# Altium project Test1.PrjPcb
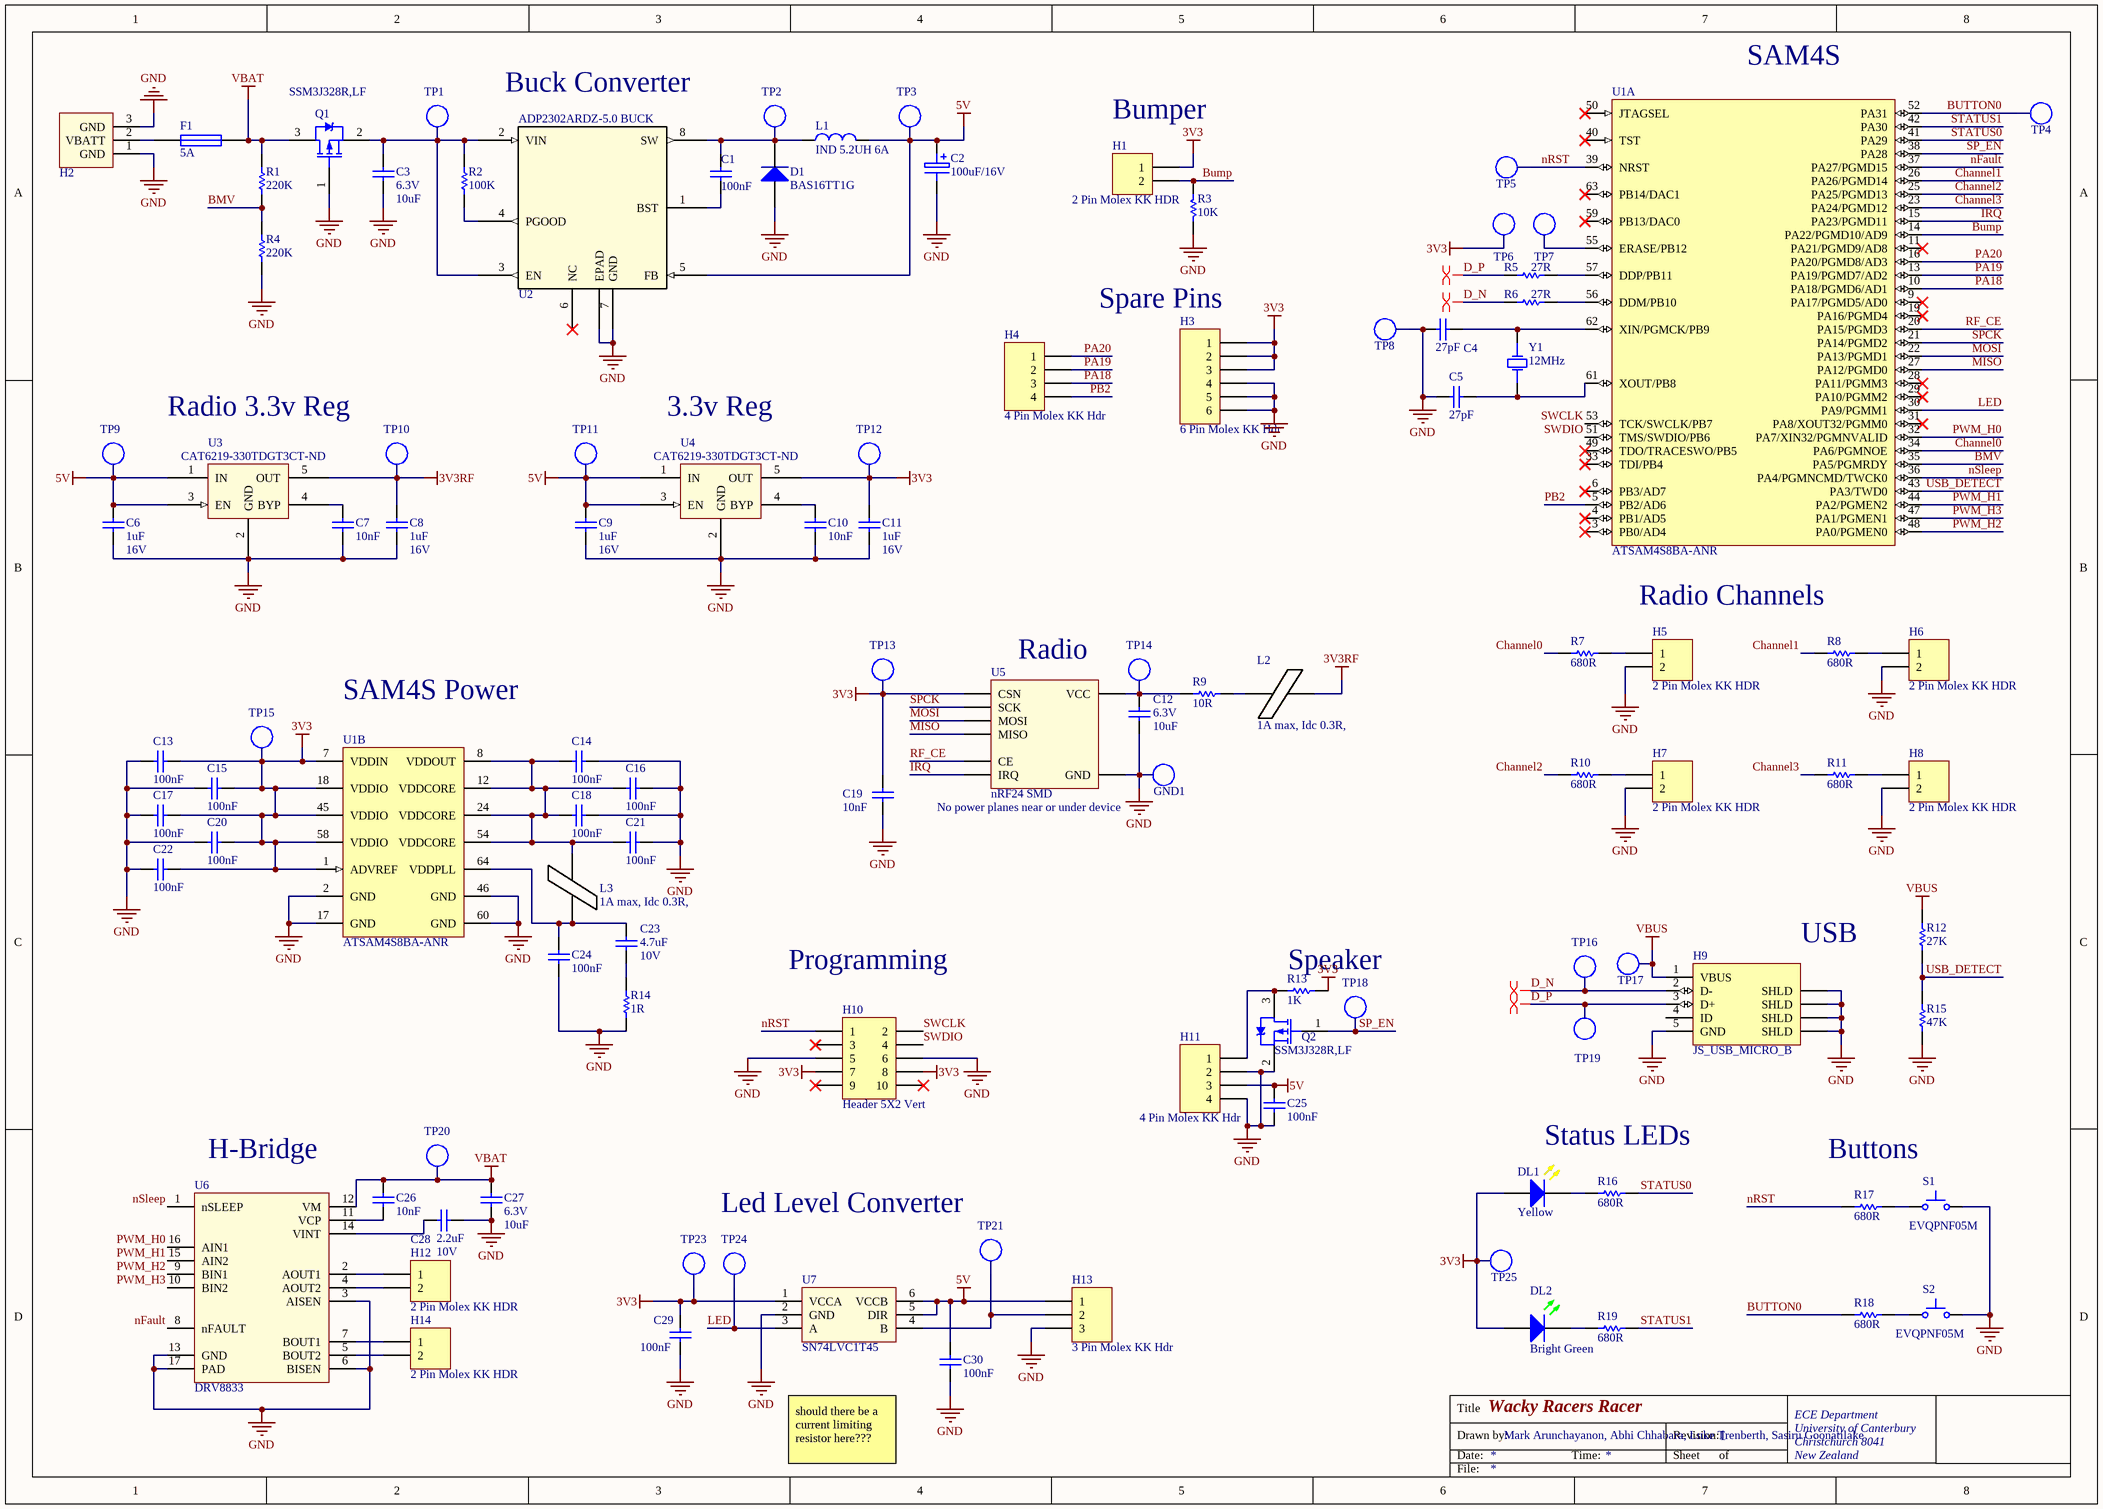
[diagram p0: racer.SchDoc]
1 sheet, 107 parts. Net scope: global (net labels, ports and power ports of the same name join across sheets).
Board file: Group9Racer.PcbDoc

## Sheet racer.SchDoc: Wacky Racers Racer
size A3; DrawnBy: Mark Arunchayanon, Abhi Chhabara, Luke Trenberth, Sasiru Goonatilake; Address1: ECE Department; Address2: University of Canterbury; Address3: Christchurch 8041; Address4: New Zealand; Revision: 1

### Parts
C1  100nF  [CAPC1608L]
C2  100uF/16V  [NICH-1]
C3  Voltage - Rated: 6.3V  [CAPC1608L]  (hidden comment: 10uF)
C4  27pF  [CAPC1608L]
C5  27pF  [CAPC1608L]
C6  Max Voltage: 16V  [CAPC1608L]  (hidden comment: 1uF)
C7  10nF  [CAPC1608L]
C8  Max Voltage: 16V  [CAPC1608L]  (hidden comment: 1uF)
C9  Max Voltage: 16V  [CAPC1608L]  (hidden comment: 1uF)
C10  10nF  [CAPC1608L]
C11  Max Voltage: 16V  [CAPC1608L]  (hidden comment: 1uF)
C12  Voltage - Rated: 6.3V  [CAPC1608L]  (hidden comment: 10uF)
C13  100nF  [CAPC1608L]
C14  100nF  [CAPC1608L]
C15  100nF  [CAPC1608L]
C16  100nF  [CAPC1608L]
C17  100nF  [CAPC1608L]
C18  100nF  [CAPC1608L]
C19  10nF  [CAPC1608L]
C20  100nF  [CAPC1608L]
C21  100nF  [CAPC1608L]
C22  100nF  [CAPC1608L]
C23  Max Voltage: 10V  [CAPC1608N]  (hidden comment: 4.7uF)
C24  100nF  [CAPC1608L]
C25  100nF  [CAPC1608L]
C26  10nF  [CAPC1608L]
C27  Voltage - Rated: 6.3V  [CAPC1608L]  (hidden comment: 10uF)
C28  Max Voltage: 10V  [CAPC1608L]  (hidden comment: 2.2uF)
C29  100nF  [CAPC1608L]
C30  100nF  [CAPC1608L]
D1  BAS16TT1G  [SOT416]
DL1  Yellow  [WL-SMCW0603]
DL2  Bright Green  [WL-SMCW0603]
F1  5A  [RESC3216N]
GND1  GND  [TP_0603]  (value not drawn)
H1  2 Pin Molex KK HDR  [MOLEX_KK_2_HDR]
H2  Battery_HEADER_3pin  [BATT_HEADER_3POS]  (value not drawn)
H3  6 Pin Molex KK Hdr  [MOLEX_KK_6_HDR]
H4  4 Pin Molex KK Hdr  [MOLEX_KK_4_HDR]
H5  2 Pin Molex KK HDR  [MOLEX_KK_2_HDR]
H6  2 Pin Molex KK HDR  [MOLEX_KK_2_HDR]
H7  2 Pin Molex KK HDR  [MOLEX_KK_2_HDR]
H8  2 Pin Molex KK HDR  [MOLEX_KK_2_HDR]
H9  JS_USB_MICRO_B  [FCI_USB_10118194-0001LF]
H10  Header 5X2 Vert  [IDC2.54-V10D]
H11  4 Pin Molex KK Hdr  [MOLEX_KK_4_HDR]
H12  2 Pin Molex KK HDR  [MOLEX_KK_2_HDR]
H13  3 Pin Molex KK Hdr  [MOLEX_KK_3_HDR]
H14  2 Pin Molex KK HDR  [MOLEX_KK_2_HDR]
L1  IND 5.2UH 6A  [INDUCTOR5u2]
L2  1A max, Idc 0.3R,  [INDC3216L]
L3  1A max, Idc 0.3R,  [INDC3216L]
Q1  SSM3J328R,LF  [SOT23_L]
Q2  SSM3J328R,LF  [SOT23_L]
R1  220K  [RESC1608L]
R2  100K  [RESC1608L]
R3  10K  [RESC1608L]
R4  220K  [RESC1608L]
R5  27R  [RESC3216L]
R6  27R  [RESC3216L]
R7  680R  [RESC1608L]
R8  680R  [RESC1608L]
R9  10R  [RESC1608L]
R10  680R  [RESC1608L]
R11  680R  [RESC1608L]
R12  27K  [RESC1608L]
R13  1K  [RESC1608L]
R14  1R  [RESC3216L]
R15  47K  [RESC1608N]
R16  680R  [RESC1608L]
R17  680R  [RESC1608L]
R18  680R  [RESC1608L]
R19  680R  [RESC1608L]
S1  EVQPNF05M  [EVQPNF05M]
S2  EVQPNF05M  [EVQPNF05M]
TP1  VBAT  [TP_0603]  (value not drawn)
TP2  5V  [TP_0603]  (value not drawn)
TP3  5V  [TP_0603]  (value not drawn)
TP4  TP_0603  [TP_0603]  (value not drawn)
TP5  nRST  [TP_0603]  (value not drawn)
TP6  3V3  [TP_0603]  (value not drawn)
TP7  Erase  [TP_0603]  (value not drawn)
TP8  GND  [TP_0603]  (value not drawn)
TP9  5V  [TP_0603]  (value not drawn)
TP10  3V3RF  [TP_0603]  (value not drawn)
TP11  5V  [TP_0603]  (value not drawn)
TP12  3V3  [TP_0603]  (value not drawn)
TP13  3V3  [TP_0603]  (value not drawn)
TP14  3V3RF  [TP_0603]  (value not drawn)
TP15  3V3  [TP_0603]  (value not drawn)
TP16  D_N  [TP_0603]  (value not drawn)
TP17  VBUS  [TP_0603]  (value not drawn)
TP18  SP_EN  [TP_0603]  (value not drawn)
TP19  D_P  [TP_0603]  (value not drawn)
TP20  VBAT  [TP_0603]  (value not drawn)
TP21  LEDB  [TP_0603]  (value not drawn)
TP23  3V3  [TP_0603]  (value not drawn)
TP24  LEDA  [TP_0603]  (value not drawn)
TP25  3V3  [TP_0603]  (value not drawn)
U1  ATSAM4S8BA-ANR  [LQFP64_L]  (parts A,B of 2)
U2  ADP2302ARDZ-5.0 BUCK  [RD_8_1]
U3  Supplier Part Number: CAT6219-330TDGT3CT-ND  [SOT95P280X145-5N]  (hidden comment: CAT6219-330TDGT3)
U4  Supplier Part Number: CAT6219-330TDGT3CT-ND  [SOT95P280X145-5N]  (hidden comment: CAT6219-330TDGT3)
U5  nRF24 SMD  Warning: No power planes near or under device  [NRF24]
U6  DRV8833  [HTSOP16]
U7  SN74LVC1T45  [SOT23-6_N]
Y1  12MHz  [6.0X3.5-4]

### Nets
3V3: C11.2 C13.1 C15.1 C17.1 C19.2 C20.1 C22.1 C29.1 DL1.2(A) DL2.2(A) H1.1 H3.1 H3.2 H3.3 H10.7 H10.8 R13.2 TP6.1(TP) TP12.1(TP) TP13.1(TP) TP15.1(TP) TP23.1(TP) TP25.1(TP) U1.1(ADVREF) U1.7(VDDIN) U1.18(VDDIO) U1.45(VDDIO) U1.58(VDDIO) U4.5(OUT) U5.4(CSN) U7.1(VCCA)
3V3RF: C8.2 L2.2 TP10.1(TP) U3.5(OUT)
5V: C2.2 C6.2 C9.2 C25.2 C30.1 H11.3 H13.1 L1.2 TP3.1(TP) TP9.1(TP) TP11.1(TP) U2.5(FB) U3.1(IN) U3.3(EN) U4.1(IN) U4.3(EN) U7.5(DIR) U7.6(VCCB)
GND: C2.1 C3.1 C4.2 C5.2 C6.1 C7.1 C8.1 C9.1 C10.1 C11.1 C12.1 C13.2 C14.1 C15.2 C16.1 C17.2 C18.1 C19.1 C20.2 C21.1 C22.2 C24.2 C25.1 C27.1 C28.2 C29.2 C30.2 D1.1(A) GND1.1(TP) H2.1(GND) H2.3(GND) H3.4 H3.5 H3.6 H5.2 H6.2 H7.2 H8.2 H9.5(GND) H9.6(SHLD) H10.5 H10.6 H11.2 H11.4 H13.3 Q1.1 Q2.2 R3.1 R4.1 R14.1 R15.1 S1.2 S2.2 TP8.1(TP) U1.2(GND) U1.17(GND) U1.46(GND) U1.60(GND) U2.7(GND) U2.EPAD U3.2(GND) U4.2(GND) U5.2(GND) U6.3(AISEN) U6.6(BISEN) U6.13(GND) U6.17(PAD) U7.2(GND)
VBAT: C26.1 C27.2 F1.2 Q1.3 R1.2 TP20.1(TP) U6.12(VM)
VBUS: H9.1(VBUS) R12.2 TP17.1(TP)
BMV: R1.1 R4.2 U1.35(PA5/PGMRDY)
Bump: H1.2 R3.2 U1.14(PA22/PGMD10/AD9)
BUTTON0: R18.1 TP4.1(TP) U1.52(PA31)
Channel0: R7.1 U1.34(PA6/PGMNOE)
Channel1: R8.1 U1.26(PA26/PGMD14)
Channel2: R10.1 U1.25(PA25/PGMD13)
Channel3: R11.1 U1.23(PA24/PGMD12)
D_N: H9.2(D-) R6.1 TP16.1(TP)
D_P: H9.3(D+) R5.1 TP19.1(TP)
IRQ: U1.15(PA23/PGMD11) U5.8(IRQ)
LED: TP24.1(TP) U1.30(PA9/PGMM1) U7.3(A)
MISO: U1.27(PA12/PGMD0) U5.7(MISO)
MOSI: U1.22(PA13/PGMD1) U5.6(MOSI)
nFault: U1.37(PA27/PGMD15) U6.8(nFAULT)
nRST: H10.1 R17.1 TP5.1(TP) U1.39(NRST)
nSleep: U1.36(PA4/PGMNCMD/TWCK0) U6.1(nSLEEP)
PA18: H4.3 U1.10(PA18/PGMD6/AD1)
PA19: H4.2 U1.13(PA19/PGMD7/AD2)
PA20: H4.1 U1.16(PA20/PGMD8/AD3)
PB2: H4.4 U1.5(PB2/AD6)
PWM_H0: U1.32(PA7/XIN32/PGMNVALID) U6.16(AIN1)
PWM_H1: U1.44(PA2/PGMEN2) U6.15(AIN2)
PWM_H2: U1.48(PA0/PGMEN0) U6.9(BIN1)
PWM_H3: U1.47(PA1/PGMEN1) U6.10(BIN2)
RF_CE: U1.20(PA15/PGMD3) U5.3(CE)
SP_EN: Q2.1 TP18.1(TP) U1.38(PA28)
SPCK: U1.21(PA14/PGMD2) U5.5(SCK)
STATUS0: R16.2 U1.41(PA29)
STATUS1: R19.2 U1.42(PA30)
SWCLK: H10.2 U1.53(TCK/SWCLK/PB7)
SWDIO: H10.4 U1.51(TMS/SWDIO/PB6)
USB_DETECT: R12.1 R15.2 U1.43(PA3/TWD0)
NetC1_1: C1.1 D1.3(K) L1.1 TP2.1(TP) U2.8(SW)
NetC1_2: C1.2 U2.1(BST)
NetC3_2: C3.2 Q1.2 R2.2 TP1.1(TP) U2.2(VIN) U2.3(EN)
NetC4_1: C4.1 U1.62(XIN/PGMCK/PB9) Y1.3(OSC2)
NetC5_1: C5.1 U1.61(XOUT/PB8) Y1.1(OSC1)
NetC7_2: C7.2 U3.4(BYP)
NetC10_2: C10.2 U4.4(BYP)
NetC12_2: C12.2 R9.1 TP14.1(TP) U5.1(VCC)
NetC14_2: C14.2 C16.2 C18.2 C21.2 L3.2 U1.8(VDDOUT) U1.12(VDDCORE) U1.24(VDDCORE) U1.54(VDDCORE)
NetC23_1: C23.1 R14.2
NetC23_2: C23.2 C24.1 L3.1 U1.64(VDDPLL)
NetC26_2: C26.2 U6.11(VCP)
NetC28_1: C28.1 U6.14(VINT)
NetDL1_1: DL1.1(K) R16.1
NetDL2_1: DL2.1(K) R19.1
NetF1_1: F1.1 H2.2(VBATT)
NetH5_1: H5.1 R7.2
NetH6_1: H6.1 R8.2
NetH7_1: H7.1 R10.2
NetH8_1: H8.1 R11.2
NetH11_1: H11.1 Q2.3 R13.1
NetH12_1: H12.1 U6.2(AOUT1)
NetH12_2: H12.2 U6.4(AOUT2)
NetH13_2: H13.2 TP21.1(TP) U7.4(B)
NetH14_1: H14.1 U6.7(BOUT1)
NetH14_2: H14.2 U6.5(BOUT2)
NetL2_1: L2.1 R9.2
NetR2_1: R2.1 U2.4(PGOOD)
NetR5_2: R5.2 U1.57(DDP/PB11)
NetR6_2: R6.2 U1.56(DDM/PB10)
NetR17_2: R17.2 S1.1
NetR18_2: R18.2 S2.1
NetTP7_1: TP7.1(TP) U1.55(ERASE/PB12)

Not connected (* = marked no-connect by the designer): H9 4(ID); H10 3* 9* 10*; U1 3(PB0/AD4)* 4(PB1/AD5)* 6(PB3/AD7)* 9(PA17/PGMD5/AD0)* 11(PA21/PGMD9/AD8)* 19(PA16/PGMD4)* 28(PA11/PGMM3)* 29(PA10/PGMM2)* 31(PA8/XOUT32/PGMM0)* 33(TDI/PB4)* 40(TST)* 49(TDO/TRACESWO/PB5)* 50(JTAGSEL)* 59(PB13/DAC0)* 63(PB14/DAC1)*; U2 6(NC)*

### Layout directives
differential pair: D_N, D_P

### Notes on the sheet
- (near U2) Buck Converter
- (near U1) SAM4S
- (near H1) Bumper
- (near H3) Spare Pins
- Radio 3.3v Reg
- 3.3v Reg
- Radio Channels
- SAM4S Power
- (near U5) Radio
- Programming
- (near R13) Speaker
- (near H9) USB
- H-Bridge
- Status LEDs
- Buttons
- Led Level Converter
- should there be a current limiting resistor here???
- Title
- Drawn by:
- Date:
- Time:
- Revision:
- Sheet
- of
- File:

### Library data of the parts
C1 C13-C18 C20-C22 C24 C25 C29 C30 = CC_100nF_0603: CAP CER 100nF X7R +-10% 50V 0603; PackageReference: 0603; Code_IPC: 1608 [0603]; Verify: *; Supplier: ECE Dept; Storage Location: PCB Assembly WS; Value: 100nF
C2 = CA_100uF_16V: CAP ALUM 100uF 16V SMD; Manufacturer PN: UWX1C101MCL1GB; Manufacturer: Nichcon; Supplier 1: Farnell; Supplier Part Number 1: 1870677; Storage Location: PCB Assembly WS; Supplier: ECE Dept; Supplier 2: Digi-Key; Supplier Part Number 2: 493-2105-1-ND; Value: 100uF/16V
C3 C12 C27 = CC_10uF_0603: CAP CER 10UF X5R +-20% 6V3 0603; Supplier: ECE Dept; Storage Location: PCB Assembly WS; Value: 10uF
C4 C5 = CC_27pF_0603: CAP CER 27pF NPO/COG +-5% 50V 0603; PackageReference: 0603; Code_IPC: 1608 [0603]; Verify: *; Supplier: ECE Dept; Storage Location: PCB Assembly WS; Value: 27pF
C6 C8 C9 C11 = CC_1uF_0603: CAP CER 1uF Y5V -20% +80% 16V 0603; PackageReference: 0603; Code_IPC: 1608 [0603]; Verify: *; Supplier: ECE Dept; Storage Location: PCB Assembly WS; Value: 1uF
C7 C10 C19 C26 = CC_10nF_0603: CAP CER 10nF X7R +-10% 50V 0603; PackageReference: 0603; Code_IPC: 1608 [0603]; Verify: *; Supplier: ECE Dept; Storage Location: PCB Assembly WS; Value: 10nF
C23 = CC_4.7uF_0603: CAP CER 4.7uF X5R +-20%  10V 0603; Note: Footprint corresponds to dimensions for bulk cassette packaging. This case size has tightened tolerances.; PackageReference: 0805; Code_IPC: 2012[0805]; Verify: *; Supplier: ECE Dept; Storage Location: PCB Assembly WS; Value: 4.7uF
C28 = CC_2.2uF_0603: CAP CER 2.2uF X5R +-20% 10V 0603; PackageReference: 0603; Code_IPC: 1608 [0603]; Verify: *; Supplier: ECE Dept; Storage Location: PCB Assembly WS; Value: 2.2uF
D1 = DR_BAS16TT1G: Diode Switching, Vr 75V, 200mA, SOT-416; Manufacturer: ON Semiconductor; Max Surge Current: 500mA; Forward Voltage: 1.25V; Peak Reverse Current: 1uA; Recovery Time: 6ns; Power Dissipation: 225mW; Element Configuration: Single; Polarity: Standard; Max Reverse Voltage (DC): 100V; Manufacturer PN: BAS16TT1G; Storage Location: PCB Assembly WS; Supplier: ECE Dept; Manufacturer Part Number: BAS16TT1G; Case/Package: SOT-416-3; Number of Pins: 3; Contact Plating: Tin,Matte; Min Operating Temperature: -55°C; Max Operating Temperature: 150°C; Package Quantity: 1; Packaging: Tape and Reel; Forward Current: 200mA; Average Rectified Current: 200mA; Reverse Recovery Time: 6ns; Peak Non-Repetitive Surge Current: 500mA; Max Repetitive Reverse Voltage (Vrrm): 75V; Max Forward Surge Current (Ifsm): 500mA; Current Rating: 200mA; Output Current: 200mA; Length: 1.65mm; Height: 0.9mm; Width: 0.9mm; Radiation Hardening: No; REACH SVHC: No SVHC; Lead Free: Lead Free; Halogen Free: Halogen Free; ComponentLink1URL: https://datasheet.ciiva.com/8299/bas16tt1-d-8299729.pdf; ComponentLink1Description: https://datasheet.ciiva.com/8299/bas16tt1-d-8299729.pdf; ComponentLink2URL: https://datasheet.ciiva.com/4435/bas16tt1-d-103455-4435027.pdf; ComponentLink2Description: https://datasheet.ciiva.com/4435/bas16tt1-d-103455-4435027.pdf; ComponentLink3URL: https://datasheet.ciiva.com/28646/bas16tt1-d-28646580.pdf; ComponentLink3Description: https://datasheet.ciiva.com/28646/bas16tt1-d-28646580.pdf; ComponentLink4URL: https://datasheet.ciiva.com/16393/bas16tt1-d-16393622.pdf; ComponentLink4Description: https://datasheet.ciiva.com/16393/bas16tt1-d-16393622.pdf; ComponentLink5URL: https://datasheet.ciiva.com/923/bas16tt1-d-923016.pdf; ComponentLink5Description: https://datasheet.ciiva.com/923/bas16tt1-d-923016.pdf; ComponentLink6URL: https://datasheet.ciiva.com/923/bas16tt1-d-923017.pdf; ComponentLink6Description: https://datasheet.ciiva.com/923/bas16tt1-d-923017.pdf; ComponentLink7URL: https://datasheet.ciiva.com/923/bas16tt1-d-923018.pdf; ComponentLink7Description: https://datasheet.ciiva.com/923/bas16tt1-d-923018.pdf; ComponentLink8URL: https://datasheet.ciiva.com/25930/bas16tt1-d-25930986.pdf; ComponentLink8Description: https://datasheet.ciiva.com/25930/bas16tt1-d-25930986.pdf; Supplier 1: Digi-Key; Supplier 2: Farnell; Supplier Part Number 2: 2844752; Supplier Part Number 1: BAS16TT1GOSDKR-ND; Value: BAS16TT1G
DL1 = DL_150060YS75000: LED Yellow 120mcd 0603 SMD; Manufacturer: WURTH ELEKTRONIK; Forward Current If: 30; Forward Voltage: 2; Wavelength Typ: 590; Lens Shape: Rectangular; Viewing Angle: 140°; Luminous Intensity: 120; LED Mounting: SMD; Supplier 1: Farnell; Supplier Part Number 1: 2322074; Manufacturer Part Number: 150060YS75000; Storage Location: PCB Assembly WS; Supplier: ECE Dept; LED Colour: Yellow
DL2 = DL_150060VS75000: LED Bright Green 40mcd 0603 SMD; Manufacturer: WURTH ELEKTRONIK; Forward Current If: 30; Forward Voltage: 2; Viewing Angle: 140°; Wavelength Typ: 570; Luminous Intensity: 40; LED Mounting: SMD; Supplier 1: Farnell; Supplier Part Number 1: 2322073; Manufacturer Part Number: 150060VS75000; Storage Location: PCB Assembly WS; Supplier: ECE Dept; LED Colour: Bright Green
F1 = FS_Fuse_5.0A: Fuse 5.0A Fast Acting 1206 SMD; Manufacturer Part Number: C1F5; Manufacturer: Bel TRP; Voltage Rating (AC): 125V; Voltage Rating (DC): 63V; DC Cold Resistance: 19mR; Fuse Type: Board Mount (Cartridge Style Excluded); Approvals: CE,cURus; Mount: Surface Mount; Case/Package: 1206; Number of Pins: 2; Case Code (Metric): 3216; Case Code (Imperial): 1206; Contact Plating: Nickel,Tin; Min Operating Temperature: -55°C; Max Operating Temperature: 125°C; Packaging: Tape and Reel; Voltage Rating: 125V; Length: 0.126inch; Width: 0.062inch; Supplier 1: Digi-Key; Stock 1: 725; Pricing 1: 1=0.32, 5=0.312, 10=0.298, 50=0.2662, 100=0.2479, 250=0.22032, 500=0.1836, 1000=0.17442 (USD); ComponentLink1URL: http://www.farnell.com/datasheets/2571625.pdf; ComponentLink1Description: http://www.farnell.com/datasheets/2571625.pdf; ComponentLink2URL: http://belfuse.com/pdfs/C1F.pdf; ComponentLink2Description: http://belfuse.com/pdfs/C1F.pdf; ComponentLink3URL: http://www.mouser.com/ds/2/643/C1F-594910.pdf; ComponentLink3Description: http://www.mouser.com/ds/2/643/C1F-594910.pdf; ComponentLink4URL: https://belfuse.com/resources/StewartConnector/C1F.pdf; ComponentLink4Description: https://belfuse.com/resources/StewartConnector/C1F.pdf; Current Rating: 5A; Supplier Part Number 1: 507-1886-1-ND; Supplier 2: Element14; Supplier Part Number 2: 2848595; Value: 5A
GND1 TP1-TP21 TP23-TP25 = TP_0603: Test Point 1.65X0.9X1.2mm SMD; Manufacturer: TE Connectivity AMP Connectors; Manufacturer Part Number: 1625854-3; Supplier 1: Digi-Key; Mounting Type: Surface Mount; Terminal: 0.063" x 0.031" x 0.045" (1.60mm x 0.80mm x 1.15mm); Type: PC Test Point; Supplier Part Number 1: A106145CT-ND
H1 H5-H8 H12 H14 = JA_MOLEX_KK_2POS: CONN HEADER 2POS 2.54mm VERT_Thru Hole; Supplier 1: Farnell; Supplier Part Number 1: 1462926; Supplier: ECE Dept; Storage Location: ECE Dept Store; Value: 2 Pin Molex KK HDR
H2 = Battery_HEADER_3pin: 3Pin Header 2.54mm spacing
H3 = JA_MOLEX_KK_6POS: CONN HEADER 6POS 2.54mm VERT_Thru Hole; Supplier 1: Farnell; Supplier Part Number 1: 1462922; Supplier: ECE Dept; Storage Location: ECE Dept Store; Value: 6 Pin Molex KK Hdr
H4 H11 = JA_MOLEX_KK_4POS: CONN HEADER 4POS 2.54mm VERT_Thru Hole; Manufacturer: Molex; Supplier 1: Farnell; Supplier Part Number 1: 9731164; Supplier: ECE Dept; Storage Location: ECE Dept Store; Value: 4 Pin Molex KK Hdr; Manufacturer PN: 22-23-2041
H9 = JS_USB_MICRO_B_SMT: CONN USB MICRO B RECPT SMT R/A; Manufacturer: FCI; Manufacturer Part Number: 10118194-0001LF; Gender: Receptacle; Number of Contacts: 5; Specifications: USB 2.0; Supplier 1: Digi-Key; Supplier Part Number 1: 609-4618-1-ND; Features: Shielded, Solder Retention; Mounting Type: Surface Mount, Right Angle, Horizontal
H10 = JA_HDR_IDC_5X2_VERT: IDC Header, 2,54mm, 10-Pin, Vert; Supplier: ECE Dept; Supplier 1: Farnell; Supplier Part Number 1: 1096985; Storage Location: ECE Dept Store
H13 = JA_MOLEX_KK_3POS: CONN HEADER 3POS 2.54mm VERT_Thru Hole; Supplier 1: Farnell; Supplier Part Number 1: 9731156; Manufacturer: Molex; Supplier: ECE Dept; Storage Location: ECE Dept Store; Value: 3 Pin Molex KK Hdr; Manufacturer PN: 22-23-2031
L1 = CDRH104RNP-5R2NC: FIXED IND 5.2UH 6A 22 MOHM SMD; Manufacturer: Sumida America Components Inc.; Material - Core: Ferrite; Tolerance: ±30%; Current - Saturation: 5.6A; Shielding: Shielded; DC Resistance (DCR): 22 mOhm Max; Supplier 1: Digi-Key; Manufacturer Part Number: CDRH104RNP-5R2NC; RoHS: RoHS Compliant; Category: Inductors, Coils, Chokes; Stock 1: 3849; Pricing 1: 1=2.9, 10=2.678, 100=1.8743, 500=1.5173 (NZD); Packaging: Cut Tape (CT); Part Status: Active; Type: -; Q @ Freq: -; Frequency - Self Resonant: -; Ratings: -; Operating Temperature: -40°C ~ 100°C; Mounting Type: Surface Mount; Package / Case: Nonstandard; Supplier Device Package: -; Size / Dimension: 0.402" L x 0.394" W (10.20mm x 10.00mm); Height - Seated (Max): 0.157" (4.00mm); ComponentLink1URL: http://products.sumida.com/products/pdf/CDRH104R.pdf; ComponentLink1Description: http://products.sumida.com/products/pdf/CDRH104R.pdf; Supplier Part Number 1: 308-2280-1-ND
L2 L3 = IN_Ferrite-Bead: Ferrite Bead, Rdc 0.3R, Z100MHZ 600R, Imax 1A, SMD 1206; Manufacturer: FAIR-RITE; Manufacturer PN: 2512066017Y1; DC Current Rating: 1; DC Resistance Max: 0.08; Ferrite Case Style: 1206 ^3216 Metric]; Frequency Range: 50MHz to 1; Impedance: 600; Impedance Tolerance: ± 25%; Supplier: ECE Dept; Storage Location: PCB Assembly WS; Ferrite Mounting: SMD; Supplier 1: Farnell; Supplier Part Number 1: 1612060; Manufacturer Part Number: 2512066017Y1; Value: 1A max, Idc 0.3R,
Q1 Q2 = TM_SSM3J328R: MOSFET P-CH 20V 6A SOT23-3; Manufacturer: Toshiba; FET Feature: Logic Level Gate, 1.5V Drive; FET Type: MOSFET P-Channel, Metal Oxide; Gate Charge (Qg) @ Vgs: 12.8nC @ 4.5V; Input Capacitance (Ciss) @ Vds: 840pF @ 10V; Power - Max: 1W; Rds On Max: 29.8mR; Drain to Source Resistance: 47.4mR; Turn-On Delay Time: 32ns; Power Dissipation: 2W; Number of Channels: 1; Turn-Off Delay Time: 107ns; Gate to Source Voltage (Vgs): 8V; Input Capacitance: 840pF; Element Configuration: Single; Drain to Source Breakdown Voltage: -20V; Vgs(th) (Max) @ Id: 1V @ 1mA; Current - Continuous Drain (Id) @ 25° C: 6A; Drain to Source Voltage (Vdss): 20V; Package / Case: SOT-23-3 Flat Leads; Supplier Device Package: SOT-23F; Pricing: 1=0.79, 10=0.658, 25=0.5772, 100=0.4939, 250=0.42836, 500=0.36284, 1000=0.27972 (NZD); Storage Location: PCB Assembly WS; Supplier: Digi-Key; ComponentLink1URL: https://datasheet.ciiva.com/11158/ssm3j328r-datasheet-en-20140301-11158652.pdf; ComponentLink1Description: https://datasheet.ciiva.com/11158/ssm3j328r-datasheet-en-20140301-11158652.pdf; Supplier Part Number: SSM3J328RLFDKR-ND; Max Operating Temperature: 150°C; Mount: Surface Mount; Packaging: Tape and Reel; Min Operating Temperature: -55°C; Continuous Drain Current (ID): 6A; Radiation Hardening: No; Max Power Dissipation: 1W; Package Quantity: 3000; Case/Package: SOT-23-3; Number of Pins: 3; Number of Elements: 1; Supplier 1: Digi-Key; Supplier Part Number 1: SSM3J328RLFDKR-ND; Manufacturer Part Number: SSM3J328R,LF
R1 R4 = RS_220K: RES 3.3K OHM 1/10W 5% 0603 SMD; Storage Location: PCB Assembly WS; Supplier: ECE Dept; Value: 220K
R2 = RS_100K: RES 100K OHM 1/10W 5% 0603 SMD; Storage Location: PCB Assembly WS; Supplier: ECE Dept; Value: 100K
R3 = RS_10K: RES 10.0K OHM 1/10W 5% 0603 SMD; Storage Location: PCB Assembly WS; Supplier: ECE Dept; Value: 10K
R5 R6 = RT_27R: RES 27R OHM 1/4W 5% 1206 SMD; Storage Location: PCB Assembly WS; Supplier: ECE Dept; Value: 27R
R7 R8 R10 R11 R16-R19 = RS_680R: RES 680 OHM 1/10W 5% 0603 SMD; Storage Location: PCB Assembly WS; Supplier: ECE Dept; Value: 680R
R9 = RS_10R: RES 10 OHM 1/10W 5% 0603 SMD; Storage Location: PCB Assembly WS; Supplier: ECE Dept; Value: 10R
R12 = RS_27K: RES 27K OHM 1/10W 5% 0603 SMD; Storage Location: PCB Assembly WS; Supplier: ECE Dept; Value: 27K
R13 = RS_1K: RES 1.0K OHM 1/10W 5% 0603 SMD; Storage Location: PCB Assembly WS; Supplier: ECE Dept; Value: 1K
R14 = RT_1R: RES 1R OHM 1/4W 5% 1206 SMD; Storage Location: PCB Assembly WS; Supplier: ECE Dept; Value: 1R
R15 = RS_47K: RES 47.0K OHM 1/10W 5% 0603 SMD; Storage Location: PCB Assembly WS; Supplier: ECE Dept; Value: 47K
S1 S2 = WS_EVQPNF05M: Panasonic 6 x 3.5mm SMD Light Touch Switch Type SMD; PackageDescription: 6.0 x 3.5 mm; Supplier 1: Farnell; Supplier Part Number 1: 2079481; Manufacturer: Panasonic; Manufacturer PN: EVQPNF05M; Supplier 2: Digi-Key; Supplier Part Number 2: P13598SCT-ND; Storage Location: PCB Assembly WS; Supplier: ECE Dept
U1 = SE_ATSAM4S16BA-MU: IC MCU 32BIT 512KB FLASH 64LQFP; Manufacturer: Atmel; Connectivity: I²C, IrDA, Memory Card, SPI, SSC, UART/USART, USB; Core Processor: ARM® Cortex®-M4; Core Size: 32-Bit; Data Converters: A/D 11x12b, D/A 2x12b; Number of I/O: 47; Peripherals: Brown-out Detect/Reset, DMA, POR, PWM, WDT; Program Memory Size: 512KB (512K x 8); RAM Size: 128K x 8; Speed: 120MHz; Voltage - Supply (Vcc/Vdd): 1.62 V ~ 3.6 V; PackageVersion: revJ, Jul-2007; PackageReference: 64PS; PackageDescription: 64-Pin Quad Flat No-Lead (QFN) Sawn, 9 x 9 x 1.0 mm Body, 0.5 mm Pitch, Exposed Pad; Code_JEDEC: MO-220VMMD-3; ComponentLink1Description: Manufacturer URL; ComponentLink1URL: http://www.atmel.com/; ComponentLink2Description: SAM4S Series Datasheet; ComponentLink2URL: http://www.atmel.com/dyn/resources/prod_documents/11100.pdf; ComponentLink3Description: SAM4S Series Summary; ComponentLink3URL: http://www.atmel.com/dyn/resources/prod_documents/11100S.pdf; Supplier 1: Digi-Key; Package / Case: 64-LQFP; Packaging: Cut Tape (CT); Program Memory Type: FLASH; Supplier Part Number 1: ATSAM4S8BA-ANRCT-ND; Manufacturer Part Number: ATSAM4S8BA-ANR
U2 = ADP2302ARDZ-5.0-R7: IC REG BUCK 5V 2A 8SOIC; Vendor: Analog Devices Inc; Frequency - Switching: 700kHz; Output Type: Fixed; Voltage - Input (Max): 20V; Manufacturer_Part_Number: ADP2302ARDZ-5.0-R7; Type: DEV; Value: Value; Supplier 1: Digi-Key; Current - Output: 2A; Voltage - Output (Min/Fixed): 5V; Supplier Part Number 1: ADP2302ARDZ-5.0-R7CT-ND
U3 U4 = SV_CAT6219-330TDGT3: IC REG LIN 3.3V 500MA TSOT23-5; Voltage - Input (Max): 5.5V; Voltage Dropout (Max): 0.5V @ 500mA; Manufacturer Part Number: CAT6219-330TDGT3; Base Part Number: CAT6219; Current - Output: 500mA; Package / Case: SOT-23-5 Thin, TSOT-23-5; Supplier: Digi-Key; Supplier Device Package: TSOT-23-5; Voltage - Output (Min/Fixed): 3.3V; ComponentLink1URL: http://www.onsemi.com/pub/Collateral/CAT6219-D.PDF; ComponentLink1Description: http://www.onsemi.com/pub/Collateral/CAT6219-D.PDF; Supplier 1: Digi-Key
U5 = NRF24: nRF24 SMD Module
U6 = DRV8833: Dual H-Bridge Motor Driver 1.5A
U7 = SN74LVC1T45: 1.8V - 5V level converter
Y1 = XT_CRYSTAL_12MHz_18pF: CRYSTAL 12MHZ 18PF 6X3.5mm SMD; Manufacturer: CTS-Frequency Controls; Manufacturer Part Number: 406C35D12M00000; ESR (Equivalent Series Resistance): 60 Ohm; Frequency Stability: ±50ppm; Frequency Tolerance: ±30ppm; Operating Mode: Fundamental; Supplier 1: Digi-Key; Height: 0.047" (1.20mm); Load Capacitance: 18pF; Mounting Type: Surface Mount; Operating Temperature: -20°C ~ 70°C; Package / Case: 4-SMD, No Lead (DFN, LCC); Size / Dimension: 0.236" L x 0.138" W (6.00mm x 3.50mm); Supplier Part Number 1: CTX855CT-ND; Frequency: 12MHz